# EAGLE design suliss-sensor-board (EAGLE 7.6.0)
CNAME: suliss sensor board v1; CREVISION: v1; DESIGNER: Daniele Costarella
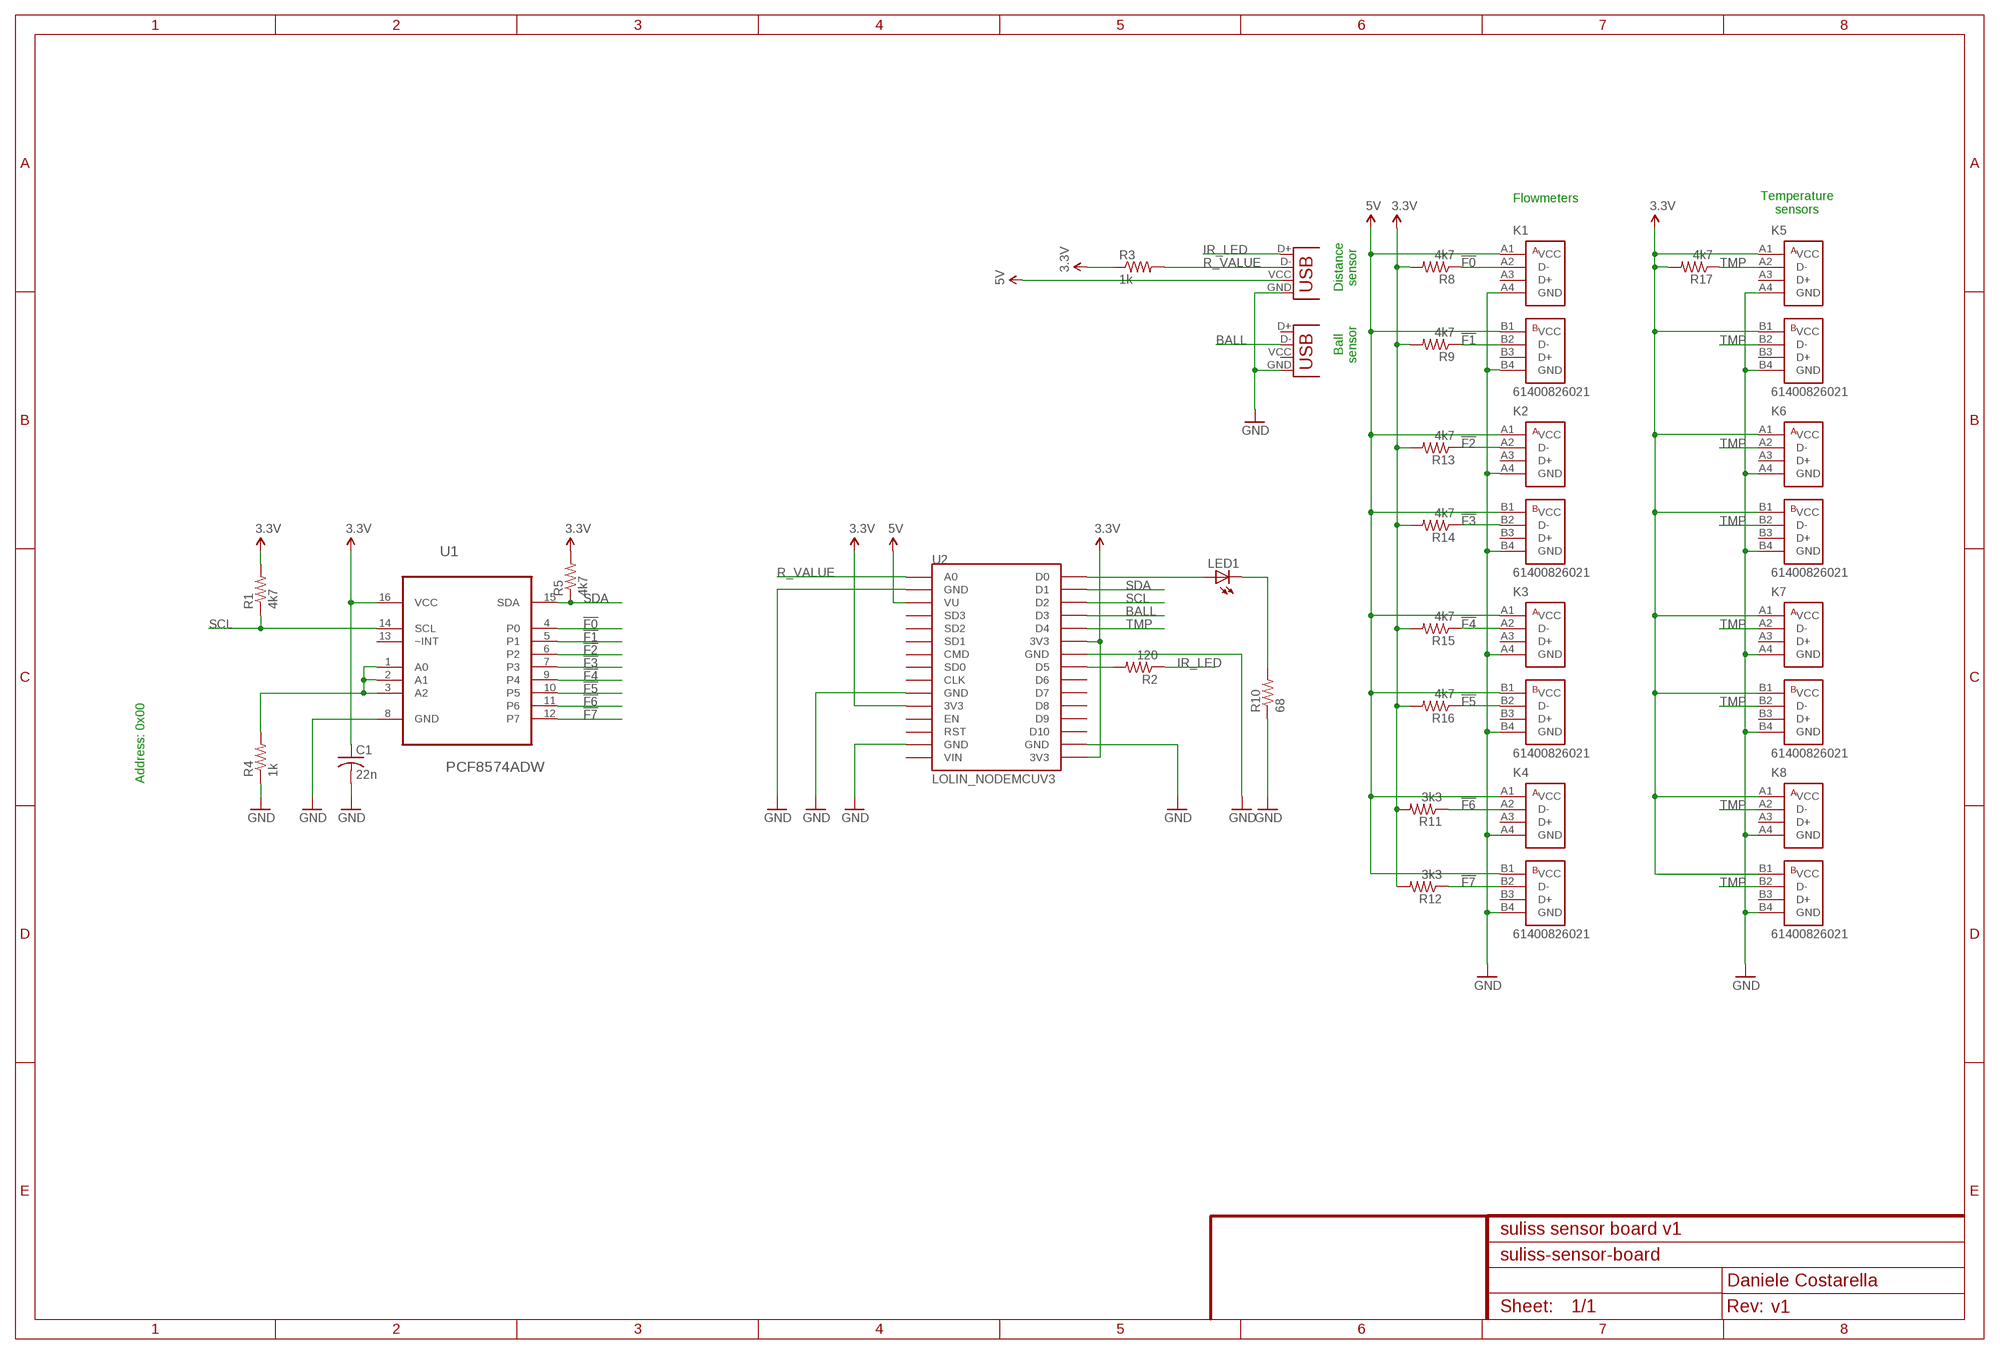
[diagram p0: schematic, sheet 1]

## Parts
C1  22n  C-USC1206  [C1206]
JP1  USB-A-H  [USB-A-VERT]
JP2  USB-A-H  [USB-A-VERT]
K1  61400826021  [61400826021]
K2  61400826021  [61400826021]
K3  61400826021  [61400826021]
K4  61400826021  [61400826021]
K5  61400826021  [61400826021]
K6  61400826021  [61400826021]
K7  61400826021  [61400826021]
K8  61400826021  [61400826021]
LED1  LEDCHIP-LED0603  [CHIP-LED0603]
R1  4k7  R-US_R0603  [R0603]
R2  120  R-US_R0603  [R0603]
R3  1k  R-US_R0603  [R0603]
R4  1k  R-US_R0603  [R0603]
R5  4k7  R-US_R0603  [R0603]
R8  4k7  R-US_R0603  [R0603]
R9  4k7  R-US_R0603  [R0603]
R10  68  R-US_R0603  [R0603]
R11  3k3  R-US_R0603  [R0603]
R12  3k3  R-US_R0603  [R0603]
R13  4k7  R-US_R0603  [R0603]
R14  4k7  R-US_R0603  [R0603]
R15  4k7  R-US_R0603  [R0603]
R16  4k7  R-US_R0603  [R0603]
R17  4k7  R-US_R0603  [R0603]
U1  PCF8574ADW  [SOIC127P1030X265-16N]
U2  LOLIN_NODEMCUV3  [ESP12E_DEVKIT_CHINA]

## Nets
3.3V: C1.1 K5.A1(VCC) K5.B1(VCC) K6.A1(VCC) K6.B1(VCC) K7.A1(VCC) K7.B1(VCC) K8.A1(VCC) K8.B1(VCC) R1.2 R3.1 R5.2 R8.2 R9.2 R11.2 R12.2 R13.2 R14.2 R15.2 R16.2 R17.2 U1.16(VCC) U2.3V3@0(3V3) U2.3V3@1(3V3) U2.3V3@2(3V3)
5V: JP1.VCC(VBUS) K1.A1(VCC) K1.B1(VCC) K2.A1(VCC) K2.B1(VCC) K3.A1(VCC) K3.B1(VCC) K4.A1(VCC) K4.B1(VCC) U2.VU
!F0: K1.A2(D-) R8.1 U1.4(P0)
!F1: K1.B2(D-) R9.1 U1.5(P1)
!F2: K2.A2(D-) R13.1 U1.6(P2)
!F3: K2.B2(D-) R14.1 U1.7(P3)
!F4: K3.A2(D-) R15.1 U1.9(P4)
!F5: K3.B2(D-) R16.1 U1.10(P5)
!F6: K4.A2(D-) R11.1 U1.11(P6)
!F7: K4.B2(D-) R12.1 U1.12(P7)
BALL: JP2.D- U2.D3
GND: C1.2 JP1.GND JP2.GND K1.A4(GND) K1.B4(GND) K2.A4(GND) K2.B4(GND) K3.A4(GND) K3.B4(GND) K4.A4(GND) K4.B4(GND) K5.A4(GND) K5.B4(GND) K6.A4(GND) K6.B4(GND) K7.A4(GND) K7.B4(GND) K8.A4(GND) K8.B4(GND) R4.1 R10.1 U1.8(GND) U2.GND@0(GND) U2.GND@1(GND) U2.GND@2(GND) U2.GND@3(GND) U2.GND@4(GND)
IR_LED: JP1.D+ R2.1
N$1: R4.2 U1.1(A0) U1.2(A1) U1.3(A2)
N$2: R2.2 U2.D5
N$4: LED1.A U2.D0
N$10: LED1.C R10.2
R_VALUE: JP1.D- R3.2 U2.A0
SCL: R1.1 U1.14(SCL) U2.D2
SDA: R5.1 U1.15(SDA) U2.D1
TMP: K5.A2(D-) K5.B2(D-) K6.A2(D-) K6.B2(D-) K7.A2(D-) K7.B2(D-) K8.A2(D-) K8.B2(D-) R17.1 U2.D4
Unconnected: JP2.D+ JP2.VCC(VBUS) K1.A3(D+) K1.B3(D+) K2.A3(D+) K2.B3(D+) K3.A3(D+) K3.B3(D+) K4.A3(D+) K4.B3(D+) K5.A3(D+) K5.B3(D+) K6.A3(D+) K6.B3(D+) K7.A3(D+) K7.B3(D+) K8.A3(D+) K8.B3(D+) U1.13(~INT) U2.CLK U2.CMD U2.D6 U2.D7 U2.D8 U2.EN U2.RST U2.RX(D9) U2.SD0 U2.SD1 U2.SD2 U2.SD3 U2.TX(D10) U2.VIN

## Notes on the sheet
- Flowmeters
- Temperature
  sensors
- Distance
  sensor
- Ball
  sensor
- Address: 0x00

## Library data of the parts
C1 = adafruit:C-US: CAPACITOR, American symbol
JP1 JP2 = common-smd:USB: USB Connectors USB-B-PTH is fully proven SKU : PRT-00139/CONN-08278 USB-miniB is fully proven SKU : PRT-00587 USB-A-PCB is untested. USB-A-H is throughly reviewed, but untested. Spark Fun Electronics SKU : PRT-00437 USB-B-SMT is throughly reviewed, but untested. Needs silkscreen touching up. USB-A-S has not been used/tested USB-MB-H has not been used/tested USB-MICROB has been used. CONN-09505
K1-K8 = Wuerth_Elektronik_eiCan_Communication_Connectors_STENCIL:61400826021: WR-COM Horizontal Dual Stacked USB Type A
LED1 = adafruit:LED: LED OSRAM: - CHIPLED LG R971, LG N971, LY N971, LG Q971, LY Q971, LO R971, LY R971 LH N974, LH R974 LS Q976, LO Q976, LY Q976 LO Q996 - Hyper CHIPLED LW Q18S LB Q993, LB Q99A, LB R99A - SideLED LS A670, LO A670, LY A670, LG A670, LP A670 LB A673, LV A673, LT A673, LW A673 LH A674 LY A675 LS A676, LA A676, LO A676, LY A676, LW A676 LS A679, LY A679, LG A679 - Hyper Micro SIDELED® LS Y876, LA Y876, LO Y876, LY Y876 LT Y87S - SmartLED LW L88C, LW L88S LB L89C, LB L89S, LG L890 LS L89K, LO L89K, LY L89K LS L896, LA L896, LO L896, LY L896 - TOPLED LS T670, LO T670, LY T670, LG T670, LP T670 LSG T670, LSP T670, LSY T670, LOP T670, LYG T670 LG T671, LOG T671, LSG T671 LB T673, LV T673, LT T673, LW T673 LH T674 LS T676, LA T676, LO T676, LY T676, LB T676, LH T676, LSB T676, LW T676 LB T67C, LV T67C, LT T67C, LS T67K, LO T67K, LY T67K, LW E67C LS E67B, LA E67B, LO E67B, LY E67B, LB E67C, LV E67C, LT E67C LW T67C LS T679, LY T679, LG T679 LS T770, LO T770, LY T770, LG T770, LP T770 LB T773, LV T773, LT T773, LW T773 LH T774 LS E675, LA E675, LY E675, LS T675 LS T776, LA T776, LO T776, LY T776, LB T776 LHGB T686 LT T68C, LB T68C - Hyper Mini TOPLED® LB M676 - Mini TOPLED Santana® LG M470 LS M47K, LO M47K, LY M47K Source: http://www.osram.convergy.de/
R1-R5 R8-R17 = adafruit:R-US_: RESISTOR, American symbol
U1 = Texas Instruments_By_element14_Batch_1:PCF8574ADW: REMOTE 8-BIT I/O EXPANDER FOR I2C BUS; MPN: PCF8574ADW; OC_FARNELL: 1758146; OC_NEWARK: 75C5232; PACKAGE: SOIC-16; SUPPLIER: Texas Instruments
U2 = ESP12E_DEVKIT:LOLIN_NODEMCU: LoLin NodeMCU V3

## Board
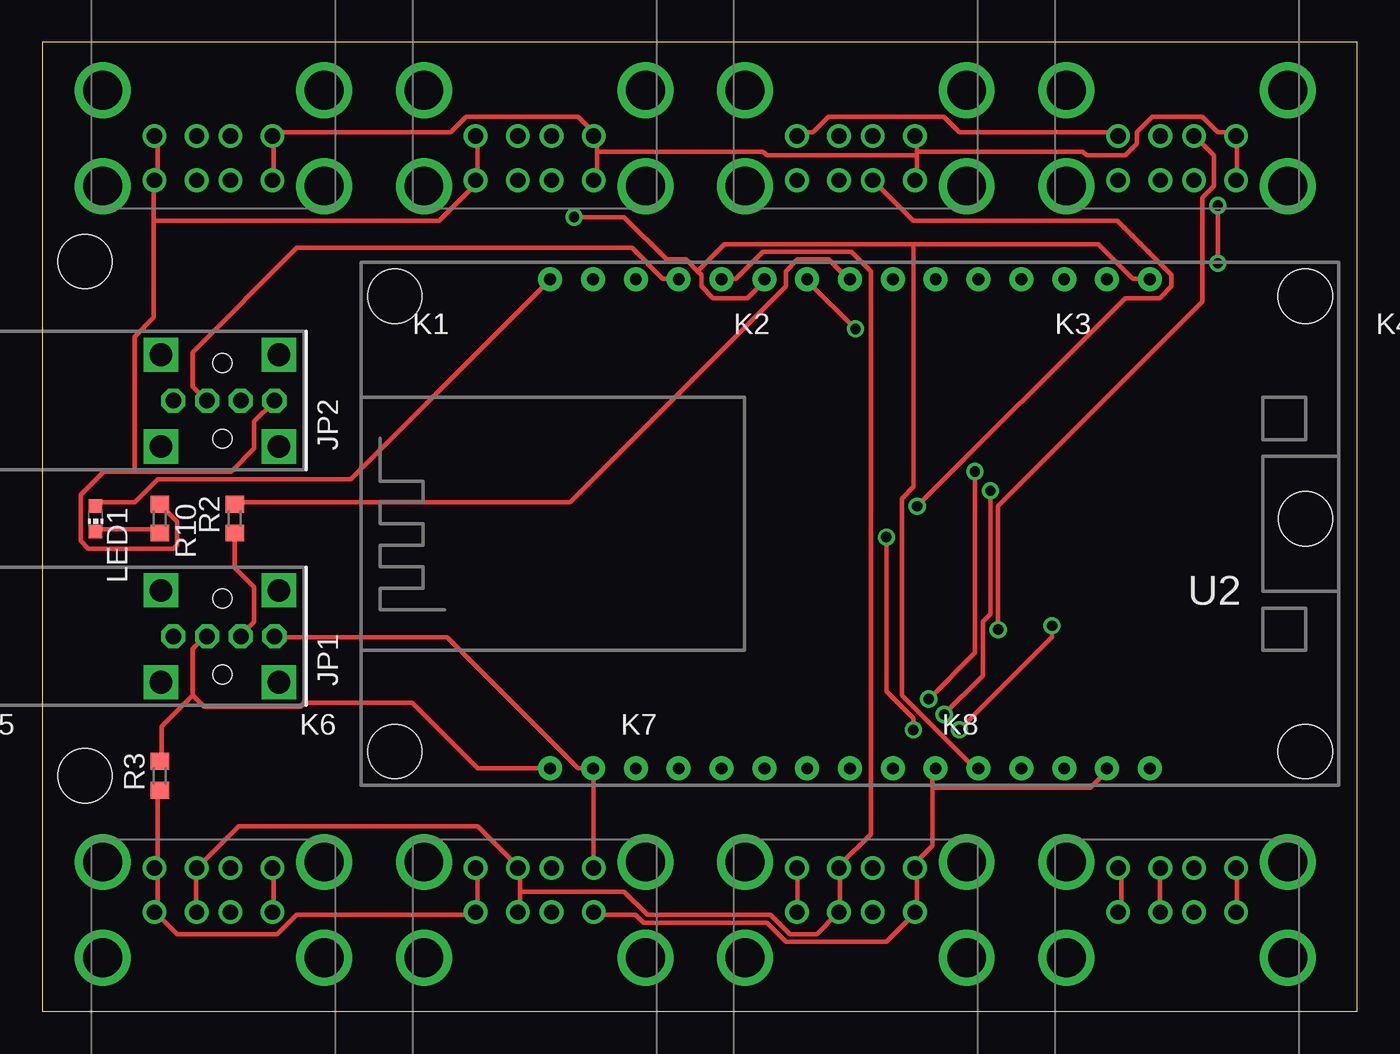
[diagram p1: board, top side]
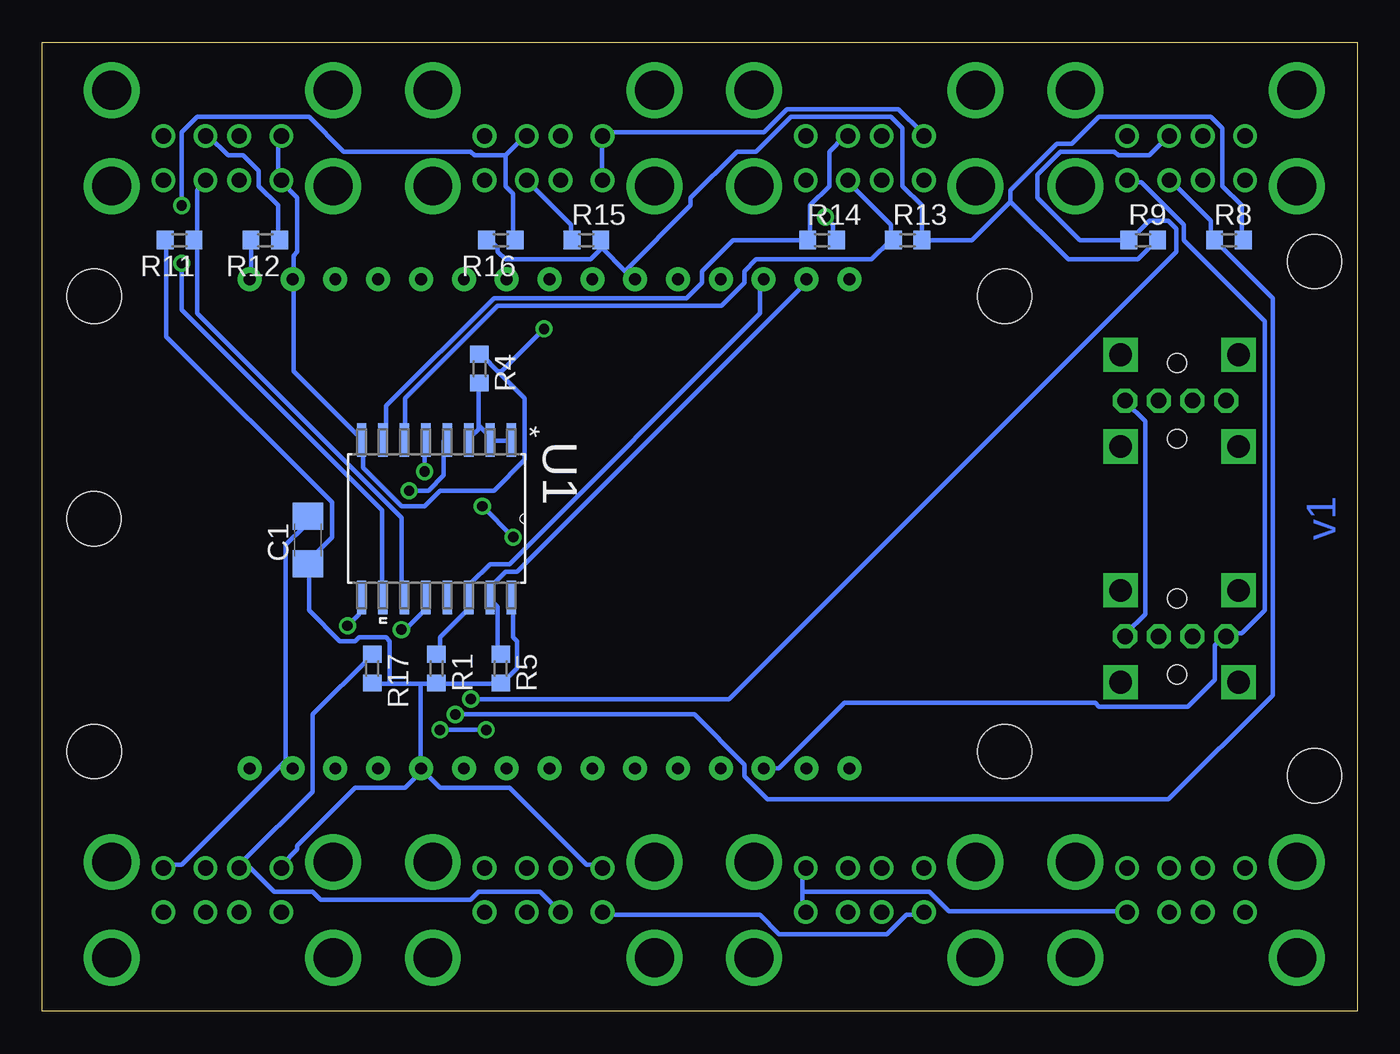
[diagram p2: board, bottom side, seen from below]

Size 78 x 57.46 mm. Coordinates in mm from the lower left corner, seen from the top.
Outline: 0,0 78,0 78,57.46 0,57.46 0,0
Copper layers (1*16): Top 0.035mm / dielectric 1.5mm / Bottom 0.035mm
Design rules "default *": minimum track width 10mil, minimum drill 24mil, track to track 8mil, track to pad 10mil, pad to pad 10mil, via to via 8mil, smd to smd 8mil, copper to edge 40mil, drill to drill 8mil, minimum pad ring 10mil, minimum via ring 8mil, stop-mask expansion 4mil, vias tented up to drill 0mil, thermal gap 10mil
Holes 3.2 mm at 2.54,44.45 2.54,13.97 74.93,29.21

### Footprints (pad centres in the part's own frame; a part is rotated, then mirrored left to right if it is on the bottom)
C1206 = smd 1.6 x 1.8: 1 -1.4,0; 2 1.4,0
USB-A-VERT = drill 0.92 octagon: D+ 0.98,0.013; D- -1.02,0.013; GND 2.98,0.013; VCC -3.02,0.013 | drill 1.35 square: P$7 3.25,2.733; P$8 3.25,-2.707; P$10 -3.75,-2.707; P$11 -3.75,2.733 | hole 1.1: -0.1,2.25; -0.1,-2.25
61400826021 = drill 2.3: 5 -6.57,5.68; 6 -6.57,0; 7 6.57,0; 8 6.57,5.68 | drill 0.9: A1 -3.5,5.33; A2 -1,5.33; A3 1,5.33; A4 3.5,5.33; B1 -3.5,2.71; B2 -1,2.71; B3 1,2.71; B4 3.5,2.71
CHIP-LED0603 = smd 0.8 x 0.8: A 0,-0.75; C 0,0.75
R0603 = smd 1 x 1.1: 1 -0.85,0; 2 0.85,0
SOIC127P1030X265-16N = smd 1.981 x 0.559: 1 -4.674,4.445; 2 -4.674,3.175; 3 -4.674,1.905; 4 -4.674,0.635; 5 -4.674,-0.635; 6 -4.674,-1.905; 7 -4.674,-3.175; 8 -4.674,-4.445; 9 4.674,-4.445; 10 4.674,-3.175; 11 4.674,-1.905; 12 4.674,-0.635; 13 4.674,0.635; 14 4.674,1.905; 15 4.674,3.175; 16 4.674,4.445
ESP12E_DEVKIT_CHINA = drill 0.7 pad 1.422: 3V3@0 -11,-13.62; 3V3@1 18,-0.92; 3V3@2 18,-23.78; A0 -11,11.78; CLK -11,-8.54; CMD -11,-3.46; D0 18,11.78; D1 18,9.24; D2 18,6.7; D3 18,4.16; D4 18,1.62; D5 18,-6; D6 18,-8.54; D7 18,-11.08; D8 18,-13.62; EN -11,-16.16; GND@0 -11,9.24; GND@1 -11,-11.08; GND@2 -11,-21.24; GND@3 18,-3.46; GND@4 18,-21.24; RST -11,-18.7; RX 18,-16.16; SD0 -11,-6; SD1 -11,-0.92; SD2 -11,1.62; SD3 -11,4.16; TX 18,-18.7; VIN -11,-23.78; VU -11,6.7 | hole 3.2: -10,21; 17,21; 17,-33; -10,-33

### Placement (x,y rotation side)
C1  62.23,27.94 90 bottom
JP1  10.79,22.23 0 top
JP2  10.79,36.2 0 top
K1  10.16,54.61 180 top
K2  29.21,54.61 180 top
K3  48.26,54.61 180 top
K4  67.31,54.61 180 top
K5  10.16,3.17 0 top
K6  29.21,3.17 0 top
K7  48.26,3.17 0 top
K8  67.31,3.17 0 top
LED1  3.17,29.21 180 top
R1  54.61,20.32 270 bottom
R2  11.43,29.21 90 top
R3  6.99,13.97 90 top
R4  52.07,38.1 270 bottom
R5  50.8,20.32 270 bottom
R8  7.62,45.72 0 bottom
R9  12.7,45.72 0 bottom
R10  6.99,29.21 270 top
R11  69.85,45.72 180 bottom
R12  64.77,45.72 180 bottom
R13  26.67,45.72 0 bottom
R14  31.75,45.72 0 bottom
R15  45.72,45.72 0 bottom
R16  50.8,45.72 180 bottom
R17  58.42,20.32 270 bottom
U1  54.61,29.21 270 bottom
U2  41.91,25.4 90 top

### Tracks (layer width: path | path; a pad name or v marks a point on that pad's centre or on a via)
3.3V  (via drill 0.61)
  Top 0.254: v31.55,47.09 34.52,47.09 37.03,44.58 38.18,44.58 38.86,43.89 | 38.86,43.89 39.09,43.66 39.09,42.98 39.78,42.29 41.83,42.29 42.75,43.2 U2.3V3@1 | 51.66,45.49 40.46,45.49 38.86,43.89 | 51.66,45.49 62.64,45.49 64.69,43.43 65.61,43.43 U2.3V3@2 | K6.A1 25.83,8.46 25.83,5.94 K6.B1 25.6,5.71 15.09,5.71 13.95,4.57 8,4.57 6.86,5.71 K5.B1 6.86,5.94 6.86,8.46 K5.A1 6.86,8.69 6.86,13.03 R3.1 | K8.B1 64.01,5.94 64.01,8.46 K8.A1 | K7.B1 44.81,5.94 44.81,8.46 K7.A1 | 51.66,45.49 51.66,31.09 50.98,30.4 50.98,18.75 55.32,14.4 U2.3V3@0
  Bottom 0.254: 20.57,48.01 20.57,48.69 17.83,51.44 16.92,51.44 15.32,53.03 8.69,53.03 8,52.35 8,48.92 6.86,47.78 6.86,45.72 R8.2 | 20.57,48.01 22.86,45.72 R13.2 25.83,45.72 25.83,47.78 26.98,48.92 26.98,52.35 27.66,53.03 33.6,53.03 35.66,50.98 36.8,50.98 39.55,48.23 39.55,47.78 43.43,43.89 | 20.57,48.01 17.14,44.58 13.03,44.58 11.89,45.72 R9.2 | R12.2 65.61,45.72 65.61,43.43 U2.3V3@2 | v31.55,47.09 31.09,46.63 31.09,45.72 R14.2 | 44.81,45.26 44.81,45.72 R15.2 44.81,45.26 | 43.43,43.89 42.98,43.43 U2.3V3@1 | 43.43,43.89 44.81,45.26 | 44.81,45.26 45.49,44.58 50.52,44.58 50.98,45.03 50.98,45.26 51.44,45.72 R16.2 | R11.2 70.64,45.72 70.64,40.01 60.81,30.18 60.81,28.12 62.18,26.75 C1.1 62.18,26.52 62.18,23.77 60.35,21.95 59.44,21.95 59.21,22.17 57.61,22.17 57.38,21.95 57.38,19.43 | 55.55,19.43 54.63,19.43 R1.2 54.41,19.43 50.98,19.43 R5.2 50.75,19.43 49.84,20.34 49.84,21.95 50.06,22.17 50.06,24.46 U1.16 | 55.55,19.43 57.38,19.43 | 57.38,19.43 58.29,19.43 R17.2 | 55.55,19.43 55.55,14.4 U2.3V3@0 | K7.A1 44.81,8.69 45.72,8.69 50.29,13.26 54.41,13.26 55.32,14.17 U2.3V3@0 | K8.A1 63.78,8.69 62.87,9.6 62.87,9.83 59.44,13.26 56.46,13.26 55.55,14.17 U2.3V3@0 | K6.B1 25.83,5.71 26.75,5.71 27.89,4.57 34.29,4.57 35.43,5.71 44.58,5.71 K7.B1
5V
  Top 0.254: K4.A1 70.87,49.38 70.87,51.89 K4.B1 70.64,52.12 69.72,52.12 68.81,53.03 65.84,53.03 64.92,52.12 64.92,51.44 64.24,50.75 61.95,50.75 61.72,50.98 51.89,50.98 | 51.89,50.98 51.89,51.89 K3.B1 | 51.89,50.98 51.89,50.75 | 51.89,50.75 51.89,49.38 K3.A1 | K1.A1 13.72,49.38 13.72,51.89 K1.B1 13.72,52.12 24.23,52.12 25.15,53.03 31.77,53.03 32.69,52.12 K2.B1 32.92,51.89 32.92,50.98 | 32.92,50.98 32.92,49.38 K2.A1 | 51.89,50.75 42.98,50.75 42.75,50.98 32.92,50.98
  Bottom 0.254: U2.VU 34.29,14.4 30.4,18.29 15.54,18.29 15.32,18.06 10.06,18.06 8.46,19.66 8.46,21.72 8,22.17 JP1.VCC 7.77,22.4 6.86,22.4 5.49,23.77 5.49,40.92 10.29,45.72 10.29,46.63 12.8,49.15 13.49,49.15 K1.A1
!F0  (via drill 0.61)
  Top 0.254: v56.24,30.86 56.24,23.55 55.78,23.09 55.78,19.89 v53.49,17.6
  Bottom 0.254: K1.A2 10.97,49.15 8.69,46.86 8.69,45.72 R8.1 8.46,45.72 5.03,42.29 5.03,18.75 11.2,12.57 34.98,12.57 36.35,13.95 36.35,14.63 39.32,17.6 v53.49,17.6 | v56.24,30.86 55.09,30.86 54.18,31.77 54.18,33.83 U1.4
!F1  (via drill 0.61)
  Top 0.254: v55.32,32 55.32,21.26 v52.58,18.52
  Bottom 0.254: K1.B2 11.2,51.89 12.34,50.75 14.17,50.75 14.4,50.98 17.6,50.98 18.97,49.61 18.97,48.23 16.46,45.72 R9.1 13.49,45.72 12.34,46.86 11.2,46.86 10.74,46.41 10.74,45.03 37.26,18.52 v52.58,18.52 | v55.32,32 55.32,33.83 U1.5
!F2
  Bottom 0.254: 27.66,45.72 27.66,46.63 30.18,49.15 K2.A2 | 27.66,45.72 28.8,44.58 35.66,44.58 36.35,43.89 36.35,43.2 37.72,41.83 50.98,41.83 56.46,36.35 56.46,34.06 U1.6 | 27.66,45.72 R13.1
!F3
  Bottom 0.254: K2.B2 30.4,51.89 31.32,50.98 31.32,48.92 32.46,47.78 32.46,45.72 R14.1 37.03,45.72 38.86,43.89 38.86,43.2 39.78,42.29 51.21,42.29 57.61,35.89 57.61,34.06 U1.7
!F4  (via drill 0.61)
  Top 0.254: v59.89,22.86 59.89,22.17 v54.41,16.69 | v51.66,16.69 51.66,17.37 50.06,18.97 v50.06,28.12 | v51.89,29.95 64.24,42.29 66.29,42.29 66.98,42.98 66.98,43.66 63.78,46.86 51.66,46.86 49.38,49.15 K3.A2
  Bottom 0.254: R15.1 46.63,45.72 46.63,46.63 49.15,49.15 K3.A2 | v59.89,22.86 59.21,23.55 59.21,24.46 U1.9 | v51.66,16.69 v54.41,16.69 | v51.89,29.95 v50.06,28.12
!F5  (via drill 0.61)
  Top 0.254: v69.72,47.78 v69.72,44.35
  Bottom 0.254: 50.52,50.75 50.52,48.92 50.06,48.46 50.06,45.72 R16.1 | 50.52,50.75 49.38,51.89 K3.B2 | v69.72,44.35 69.72,41.6 57.84,29.72 57.84,24.69 U1.10 | v69.72,47.78 69.72,52.12 68.81,53.03 62.18,53.03 60.12,50.98 52.58,50.98 52.35,50.75 50.52,50.75
!F6
  Bottom 0.254: 68.81,45.72 68.81,48.69 68.35,49.15 K4.A2 | 68.81,45.72 68.81,41.38 56.69,29.26 56.69,24.69 U1.11 | 68.81,45.72 R11.1
!F7  (via drill 0.61)
  Top 0.254: v56.69,22.63 56.69,29.95 68.81,42.06 68.81,48.23 69.49,48.92 69.49,50.75 68.35,51.89 K4.B2
  Bottom 0.254: R12.1 64.01,45.72 64.01,47.78 65.15,48.92 65.15,49.84 66.06,50.75 66.98,50.75 68.12,51.89 K4.B2 | v56.69,22.63 56.46,22.63 55.32,23.77 55.32,24.46 U1.12
BALL
  Top 0.254: U2.D3 37.72,43.43 36.8,43.43 34.98,45.26 15.09,45.26 8.91,39.09 8.91,37.03 9.6,36.35 JP2.D-
GND  (via drill 0.61)
  Top 0.254: K5.B4 13.72,5.94 13.72,8.46 K5.A4 | K6.A4 32.69,8.69 32.69,14.17 U2.GND@0 32.46,14.4 31.77,14.4 24,22.17 13.95,22.17 JP1.GND | 52.81,13.26 52.81,9.83 51.66,8.69 K7.A4 51.89,8.46 51.89,5.94 K7.B4 51.66,5.71 50.06,4.12 44.12,4.12 42.98,5.26 35.66,5.26 35.2,5.71 32.92,5.71 K6.B4 | 52.81,13.26 52.81,14.17 U2.GND@1 | K8.B4 70.87,5.94 70.87,8.46 K8.A4 | 52.81,13.26 62.18,13.26 63.09,14.17 U2.GND@2 | K1.B4 6.86,51.89 6.86,49.38 K1.A4 6.63,49.15 6.63,46.86 | 5.49,32 11.2,32 12.57,33.38 12.57,34.98 13.72,36.12 JP2.GND | 5.49,32 3.66,32 2.29,30.63 2.29,27.89 2.74,27.43 7.77,27.43 8,27.66 8,29.03 7.09,29.95 R10.1 | 6.63,46.86 6.63,41.15 5.49,40.01 5.49,32 | K2.B4 25.83,51.89 25.83,49.38 K2.A4 25.83,49.15 23.55,46.86 6.63,46.86 | v48.23,40.46 45.49,43.2 U2.GND@3 | K3.B4 44.81,52.12 45.72,52.12 46.63,53.03 53.49,53.03 54.41,52.12 63.78,52.12 K4.B4
  Bottom 0.254: 32.92,7.09 32.92,8.46 K6.A4 | 32.92,7.09 32.92,5.94 K6.B4 | 32.92,7.09 25.38,7.09 24.23,5.94 13.72,5.94 K5.B4 | 63.55,14.86 63.55,14.63 63.32,14.4 U2.GND@2 63.55,14.86 | 63.55,14.86 63.55,27.66 62.41,28.8 62.41,29.26 C1.2 | 63.55,14.86 69.72,8.69 70.64,8.69 K8.A4 | JP1.GND 13.72,22.4 12.57,23.55 12.57,34.98 13.72,36.12 JP2.GND | K3.A4 44.81,49.38 44.81,51.89 K3.B4 44.58,52.12 35.2,52.12 33.83,53.49 27.2,53.49 25.83,52.12 K2.B4 | K4.B4 64.01,51.89 64.01,49.38 K4.A4 63.78,49.15 62.87,48.23 62.87,45.03 63.09,44.81 63.09,43.43 U2.GND@4 63.09,43.2 63.09,37.95 59.21,34.06 U1.8 58.98,33.83 58.98,32.23 56.69,29.95 55.32,29.95 54.41,30.86 51.21,30.86 49.38,32.69 49.38,36.35 50.98,37.95 | 50.98,37.95 51.89,38.86 R4.1 | v48.23,40.46 50.75,37.95 50.98,37.95
IR_LED
  Top 0.254: R2.1 11.43,26.29 12.57,25.15 12.57,23.09 11.89,22.4 JP1.D+
N$1
  Bottom 0.254: U1.1 50.29,33.83 51.44,33.83 U1.2 51.44,34.06 52.12,34.75 | 52.12,34.75 52.12,34.52 52.58,34.06 U1.3 | 52.12,34.75 52.12,37.03 R4.2
N$2
  Top 0.254: R2.2 11.43,30.18 31.32,30.18 44.12,42.98 44.12,43.89 44.81,44.58 46.63,44.58 47.78,43.43 U2.D5
N$4
  Top 0.254: LED1.A 3.2,30.18 5.49,30.18 6.86,31.55 18.29,31.55 29.95,43.2 U2.D0
N$10
  Top 0.254: LED1.C 3.2,28.57 6.86,28.57 R10.2
R_VALUE
  Top 0.254: 8.91,18.75 7.09,16.92 7.09,14.86 R3.2 | 8.91,18.75 8.91,21.49 9.6,22.17 JP1.D- | 8.91,18.75 9.6,18.06 15.32,18.06 15.54,18.29 21.95,18.29 25.83,14.4 29.95,14.4 U2.A0
SCL
  Bottom 0.254: R1.1 54.41,21.26 54.41,22.17 52.81,23.77 52.81,24.46 U1.14 52.58,24.69 52.58,25.38 51.44,26.52 50.29,26.52 35.43,41.38 35.43,43.2 U2.D2
SDA
  Bottom 0.254: R5.1 50.98,21.26 50.98,24 51.44,24.46 U1.15 51.44,25.15 50.52,26.06 49.84,26.06 32.69,43.2 U2.D1
TMP
  Top 0.254: K5.B2 9.14,5.94 9.14,8.46 K5.A2 9.37,8.69 11.66,10.97 25.83,10.97 28.12,8.69 K6.A2 28.35,8.46 28.35,7.09 | 28.35,7.09 28.35,5.94 K6.B2 | K8.B2 66.29,5.94 66.29,8.46 K8.A2 | U2.D4 40.46,43.43 41.15,43.43 42.75,45.03 48.01,45.03 49.15,43.89 49.15,10.52 47.32,8.69 K7.A2 47.32,8.46 47.32,5.94 K7.B2 47.09,5.71 45.95,4.57 44.35,4.57 43.2,5.71 35.89,5.71 34.52,7.09 28.35,7.09
  Bottom 0.254: 66.06,8.91 66.29,8.69 K8.A2 66.06,8.91 | 66.06,8.91 61.95,13.03 61.95,17.6 58.52,21.03 R17.1 | 66.06,8.91 64.24,7.09 61.95,7.09 61.49,6.63 52.58,6.63 52.12,7.09 48.46,7.09 47.32,5.94 K7.B2

### Text on the board
Bottom: v1